# Altium schematic sheet ARDUINO_GPIO.SchDoc: MISKO 3.0
size A4; Date: 19.9.2021; Author: AMADEJ PAPEŽ; SheetNumber: 6; SheetTotal: 13; Version: V1.1; SheetTitle: ARDUINO_GPIO
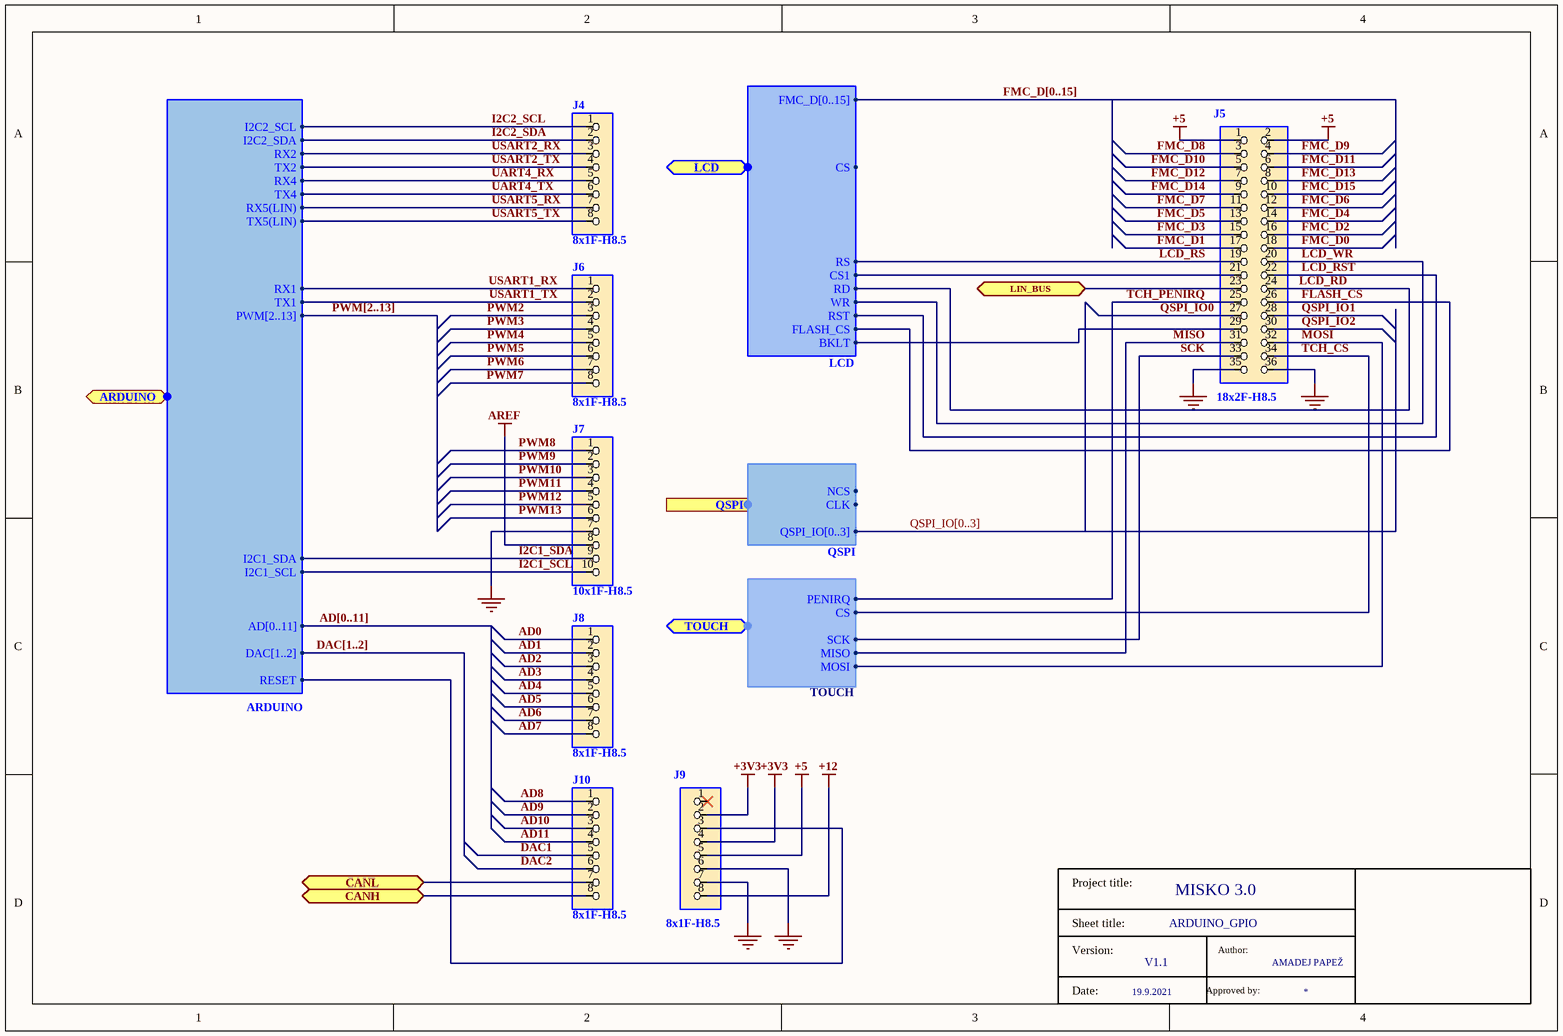
[diagram p0: ARDUINO_GPIO.SchDoc]

## Parts
J4  8x1F-H8.5  [1X08]
J5  18x2F-H8.5  [2X18]
J6  8x1F-H8.5  [1X08]
J7  10x1F-H8.5  [1X10]
J8  8x1F-H8.5  [1X08]
J9  8x1F-H8.5  [1X08]
J10  8x1F-H8.5  [1X08]
T6  (no value)

## Ports
ARDUINO (bidir, harness ARDUINO), CANH (bidir), CANL (bidir), LCD (bidir, harness LCD), LIN_BUS (bidir), QSPI (harness QSPI), TOUCH (bidir, harness TOUCH)

## Harnesses
ARDUINO: PWM[2..13], DAC[1..2], TX1, RX1, TX4, RX4, TX2, RX2, I2C2_SDA, I2C2_SCL, I2C1_SDA, I2C1_SCL, AD[0..11], TX5(LIN), RX5(LIN), RESET
TOUCH: PENIRQ, CS, SCK, MISO, MOSI
LCD: FMC_D[0..15], RST, BKLT, RD, WR, RS, CS, FLASH_CS, CS1
QSPI: NCS, CLK, QSPI_IO[0..3]

## Nets
+3V3: J9.2 J9.4
+5: J5.1 J5.2 J9.5
+12: J9.8
AREF: J7.8
GND: J5.35 J5.36 J7.7 J9.6 J9.7
AD0: J8.1
AD1: J8.2
AD2: J8.3
AD3: J8.4
AD4: J8.5
AD5: J8.6
AD6: J8.7
AD7: J8.8
AD8: J10.1
AD9: J10.2
AD10: J10.3
AD11: J10.4
CANH: J10.8 ; port CANH
CANL: J10.7 ; port CANL
DAC1: J10.5
DAC2: J10.6
FLASH_CS: J5.26 ; port LCD.FLASH_CS
FMC_D0: J5.18
FMC_D1: J5.17
FMC_D2: J5.16
FMC_D3: J5.15
FMC_D4: J5.14
FMC_D5: J5.13
FMC_D6: J5.12
FMC_D7: J5.11
FMC_D8: J5.3
FMC_D9: J5.4
FMC_D10: J5.5
FMC_D11: J5.6
FMC_D12: J5.7
FMC_D13: J5.8
FMC_D14: J5.9
FMC_D15: J5.10
I2C1_SCL: J7.10 ; port ARDUINO.I2C1_SCL
I2C1_SDA: J7.9 ; port ARDUINO.I2C1_SDA
I2C2_SCL: J4.1 ; port ARDUINO.I2C2_SCL
I2C2_SDA: J4.2 ; port ARDUINO.I2C2_SDA
LCD_RD: J5.24 ; port LCD.RD
LCD_RS: J5.19 ; port LCD.RS
LCD_RST: J5.22 ; port LCD.RST
LCD_WR: J5.20 ; port LCD.WR
LIN_BUS: J5.23 ; port LIN_BUS
MISO: J5.31 ; port TOUCH.MISO
MOSI: J5.32 ; port TOUCH.MOSI
PWM2: J6.3
PWM3: J6.4
PWM4: J6.5
PWM5: J6.6
PWM6: J6.7
PWM7: J6.8
PWM8: J7.1
PWM9: J7.2
PWM10: J7.3
PWM11: J7.4
PWM12: J7.5
PWM13: J7.6
QSPI_IO0: J5.27
QSPI_IO1: J5.28
QSPI_IO2: J5.30
SCK: J5.33 ; port TOUCH.SCK
TCH_CS: J5.34 ; port TOUCH.CS
TCH_PENIRQ: J5.25 ; port TOUCH.PENIRQ
UART4_RX: J4.5 ; port ARDUINO.RX4
UART4_TX: J4.6 ; port ARDUINO.TX4
USART1_RX: J6.1 ; port ARDUINO.RX1
USART1_TX: J6.2 ; port ARDUINO.TX1
USART2_RX: J4.3 ; port ARDUINO.RX2
USART2_TX: J4.4 ; port ARDUINO.TX2
USART5_RX: J4.7 ; port ARDUINO.RX5(LIN)
USART5_TX: J4.8 ; port ARDUINO.TX5(LIN)
NetJ5_21: J5.21 ; port LCD.CS1
NetJ5_29: J5.29 ; port LCD.BKLT
NetJ9_3: J9.3 ; port ARDUINO.RESET

Not connected (* = marked no-connect by the designer): J9 1*

## Buses and harness runs
bus AD[0..11]
bus DAC[1..2]
bus FMC_D[0..15]
bus PWM[2..13]
bus QSPI_IO[0..3]

## Notes on the sheet
- (in symbol Title block) Project title:; Sheet title:; Version:; Author:; Date:; Approved by:

## Library data of the parts
J4 J6 J8-J10 = PINHD-1X8
J5 = PINHD-2X18
J7 = PINHD-1X10
T6 = Title block